# Altium schematic sheet RF_And_SD_Ticketing_Master.SchDoc
size A4; Author: Mario Dos Santos; Organization: ETML-ES; Address1: Avenue Recordon 1; Address2: 1004 Lausanne; Address3: Switzerland; Revision: C; SheetNumber: 6; SheetTotal: 6
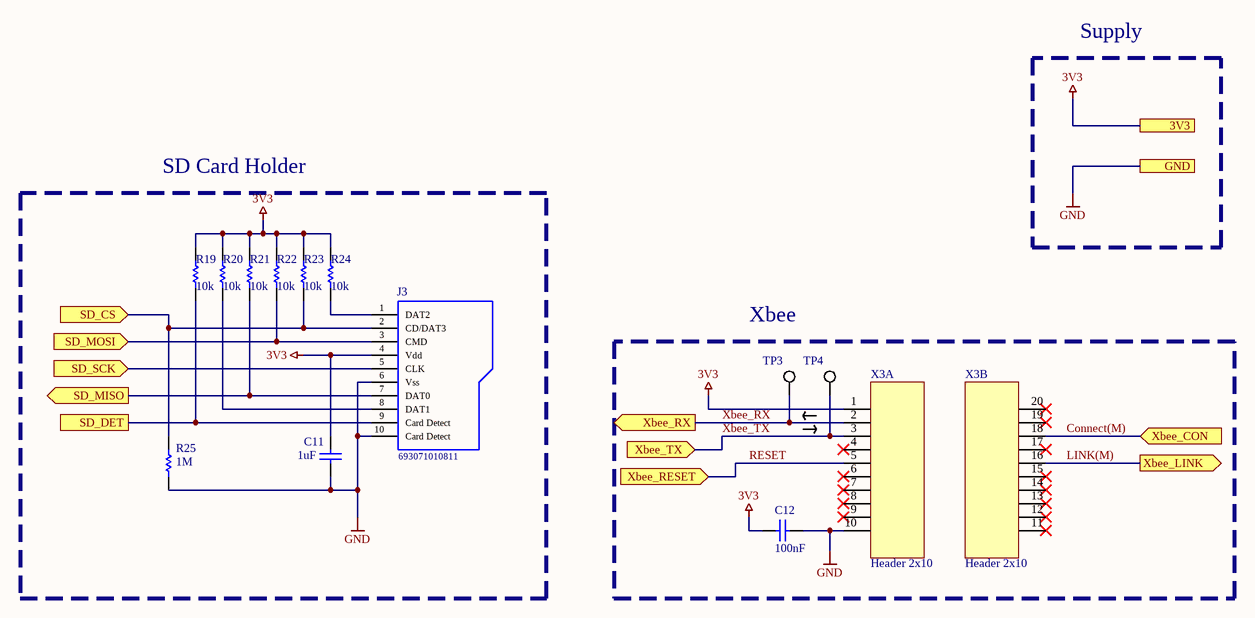
[diagram p0: RF_And_SD_Ticketing_Master.SchDoc]

## Parts
C11  1uF  [6-0805_N]
C12  100nF  [6-0805_N]
J3  693071010811  [693071010811]
R19  10k  [RESC0805(2012)_L]
R20  10k  [RESC0805(2012)_L]
R21  10k  [RESC0805(2012)_L]
R22  10k  [RESC0805(2012)_L]
R23  10k  [RESC0805(2012)_L]
R24  10k  [RESC0805(2012)_L]
R25  1M  [RESC0805(2012)_L]
TP3  (no value)  [KSTN-5019_V]
TP4  (no value)  [KSTN-5019_V]
X3  Header 2x10  [ZB-SB]  (parts A,B of 2)

## Blocks framed on the sheet
SD Card Holder: C11 J3 R19-R25
Xbee: C12 TP3 TP4 X3

## Ports
3V3, GND, SD_CS (in), SD_DET, SD_MISO (out), SD_MOSI (in), SD_SCK (in), Xbee_CON (in), Xbee_LINK (out), Xbee_RESET (in), Xbee_RX (out), Xbee_TX (in)

## Nets
3V3: C11.2 C12.2 J3.4(Vdd) R19.2 R20.2 R21.2 R22.2 R23.2 R24.2 X3.1 ; port 3V3
GND: C11.1 C12.1 J3.6(Vss) J3.10(Card_Detect) R25.1 X3.10 ; port GND
Connect(M): X3.18 ; port Xbee_CON
LINK(M): X3.16 ; port Xbee_LINK
RESET: X3.5 ; port Xbee_RESET
SD_CS: J3.2(CD/DAT3) R23.1 R25.2 ; port SD_CS
SD_DET: J3.9(Card_Detect) R19.1 ; port SD_DET
SD_MISO: J3.7(DAT0) R21.1 ; port SD_MISO
SD_MOSI: J3.3(CMD) R22.1 ; port SD_MOSI
SD_SCK: J3.5(CLK) ; port SD_SCK
Xbee_RX: TP3.1 X3.2 ; port Xbee_RX
Xbee_TX: TP4.1 X3.3 ; port Xbee_TX
NetJ3_1: J3.1(DAT2) R24.1
NetJ3_8: J3.8(DAT1) R20.1

Not connected (* = marked no-connect by the designer): X3 4* 6* 7* 8* 9* 11* 12* 13* 14* 15* 17* 19* 20*

## Notes on the sheet
- Supply
- Fichier :
- a
- Date :
- Heure :
- Version :
- Auteur :
- Modif.
- b
- c
- d
- Projet :
- No :
- Nb feuilles
- Feuille n°
- Chemin :

## Library data of the parts
C11 C12 = Cap: Capacitor; Supplier unit price: 0.1; Supplier: Digi-Key
  C11: Published: 8-Jun-2000; LatestRevisionDate: 17-Jul-2002; LatestRevisionNote: Re-released for DXP Platform.; PackageReference: RAD-0.3; Publisher: Altium Limited; PackageDescription: Radial Cap, Thru-Hole; 2 Leads; 0.3 in Pin Spacing; Value: 1uF; Supplier Part Number: 1276-2931-1-ND
  C12: Value: 100nF; Supplier Part Number: 399-C0805C104M5RAC7800CT-ND
J3 = 693071010811: WR-CRD Micro SD Card Connector, Push & Push, with card detection; Part Number: 732-3819-1-ND; Rated Current: 0.5A; Working Voltage: 500V AC; ComponentLink1Description: Manufacturer; ComponentLink1URL: http://www.we-online.de; ComponentLink2Description: Datasheet; ComponentLink2URL: http://katalog.we-online.de/em/datasheet/693071010811.pdf; Published Date: Feb. 2018; Publisher: Wurth Elektronik; Operating Temperature: -25 to 85 degC; Mounting Technology: SMT; Value: 693071010811; Supplier: Digi-Key; Supplier Part Number: 732-3819-1-ND; Supplier unit price: 2.99
R19-R25 = CMP-1013-00122-1: 100K 0.125W 5% 0805 (2012 Metric)  SMD; Case-Metric: 2012; Case-EIA: 0805; Tolerance: 5 %; Technology: SMT; Power: 0.125 W; Supplier: Digi-Key; Supplier unit price: 0.1
  R19-R24: Value: 10k; Supplier Part Number: 311-10KLGCT-ND
  R25: Value: 1M; Supplier Part Number: YAG3704CT-ND
TP3 TP4 = CMP-1672-00008-1: Test Point, 1 Position SMD, RoHS, Tape and Reel; ComponentLink1Description: Manufacturer URL; Package Quantity: 1000; DatasheetVersion: 03/2014; Packaging: Tape and Reel; ComponentLink2URL: http://www.keyelco.com/product-pdf.cfm?p=1357; ComponentLink1URL: http://www.keyelco.com/; Mount: Surface Mount; Contact Plating: Silver; PackageDescription: 1-Pin Surface Mount Device, Body 3.81 x 2.03 mm; Pins: 1; RoHSCompliant: True; Mounting Technology: Surface Mount; ComponentLink2Description: Datasheet; PackageReference: 5019; Supplier: Digi-Key; Supplier Part Number: 36-5019CT-ND; Supplier unit price: 0.33
X3 = HDR ZB-SB 2x10_1: Header 2x10 / Xbee de letml(1623) ou xbee XB24CAUIT-001; Value: Header 2x10; Supplier: Digi-Key